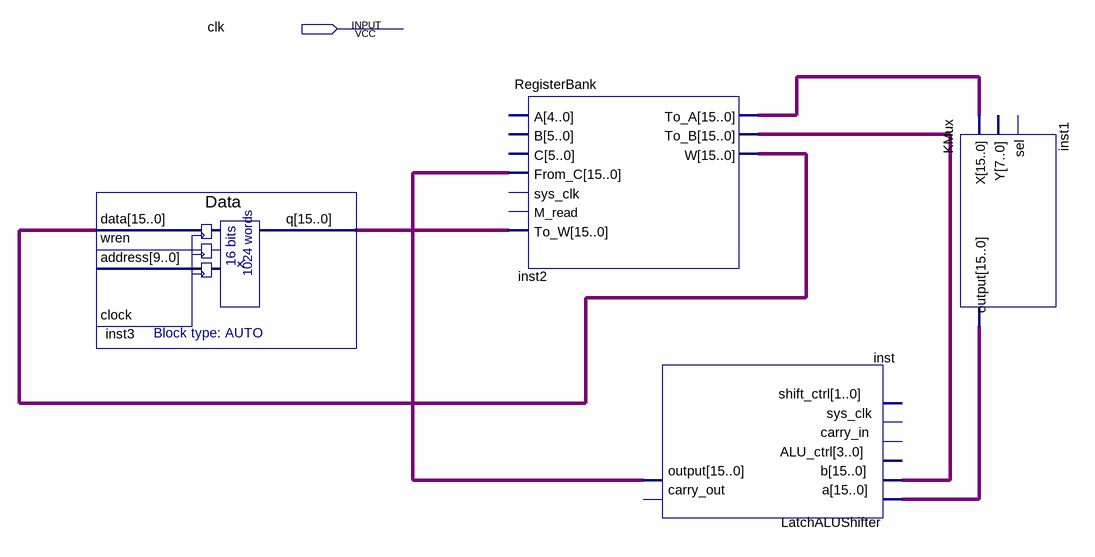
[diagram p0: schematic sheet]
// Quartus schematic EV20.bdf as structural Verilog: 4 symbols, 1 pins
module EV20 (
  input  clk
);

  wire [15:0] inst1_output, inst2_to_a, inst2_to_b, inst2_w, inst3_q, inst_output;

  Data inst3 (.data(inst2_w), .q(inst3_q));  // open: wren, address, clock
  RegisterBank inst2 (
    .From_C(inst_output), .To_W(inst3_q), .To_A(inst2_to_a), .To_B(inst2_to_b), .W(inst2_w));  // open: A, B, C, sys_clk, M_read
  LatchALUShifter inst (
    .a(inst1_output), .b(inst2_to_b), .\output (inst_output));  // open: ALU_ctrl, carry_in, sys_clk, shift_ctrl, carry_out
  KMux inst1 (.X(inst2_to_a), .\output (inst1_output));  // open: Y, sel
endmodule
